# Altium schematic sheet Sheet7.SchDoc
size A4
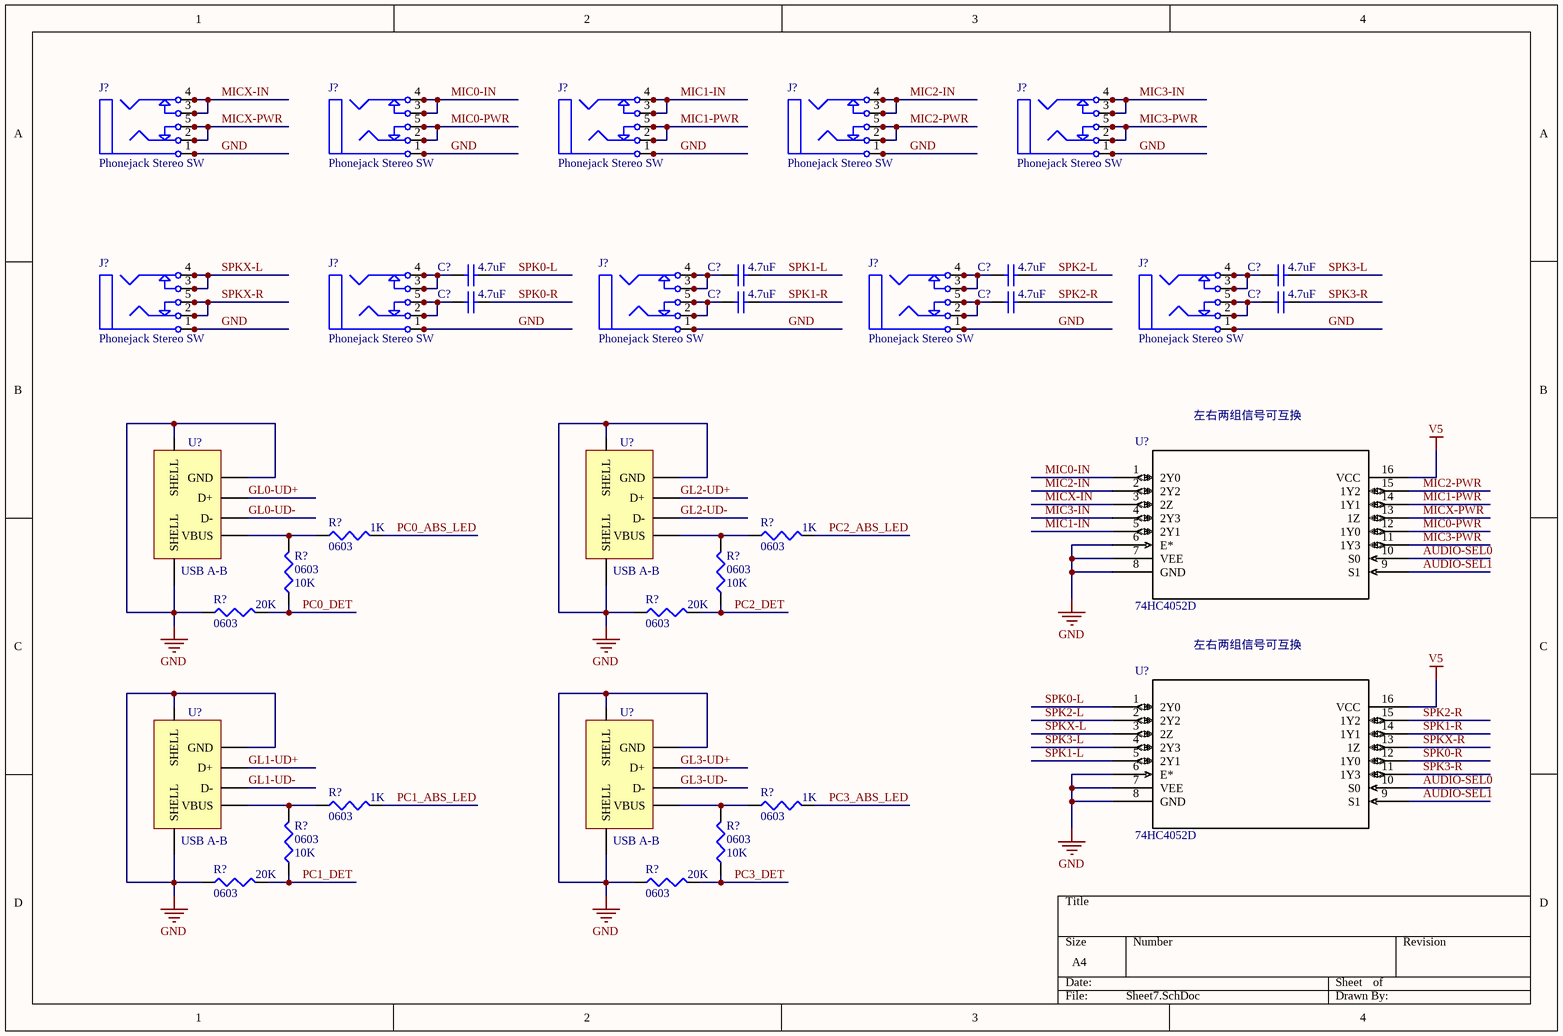
[diagram p0: Sheet7.SchDoc]

## Parts
(Parts that share a designator on the sheet are numbered #1, #2 ... from top to bottom, then left to right.)
C?#1  value 4.7uF  [1608[0603]]  (hidden comment: 0603)
C?#2  value 4.7uF  [1608[0603]]  (hidden comment: 0603)
C?#3  value 4.7uF  [1608[0603]]  (hidden comment: 0603)
C?#4  value 4.7uF  [1608[0603]]  (hidden comment: 0603)
C?#5  value 4.7uF  [1608[0603]]  (hidden comment: 0603)
C?#6  value 4.7uF  [1608[0603]]  (hidden comment: 0603)
C?#7  value 4.7uF  [1608[0603]]  (hidden comment: 0603)
C?#8  value 4.7uF  [1608[0603]]  (hidden comment: 0603)
J?#1  Phonejack Stereo SW  [ST-3150-5N]
J?#2  Phonejack Stereo SW  [ST-3150-5N]
J?#3  Phonejack Stereo SW  [ST-3150-5N]
J?#4  Phonejack Stereo SW  [ST-3150-5N]
J?#5  Phonejack Stereo SW  [ST-3150-5N]
J?#6  Phonejack Stereo SW  [ST-3150-5N]
J?#7  Phonejack Stereo SW  [ST-3150-5N]
J?#8  Phonejack Stereo SW  [ST-3150-5N]
J?#9  Phonejack Stereo SW  [ST-3150-5N]
J?#10  Phonejack Stereo SW  [ST-3150-5N]
R?#1  0603  value 1K  [J1-0603]
R?#2  0603  value 1K  [J1-0603]
R?#3  0603  value 10K  [J1-0603]
R?#4  0603  value 10K  [J1-0603]
R?#5  0603  value 20K  [J1-0603]
R?#6  0603  value 20K  [J1-0603]
R?#7  0603  value 1K  [J1-0603]
R?#8  0603  value 1K  [J1-0603]
R?#9  0603  value 10K  [J1-0603]
R?#10  0603  value 10K  [J1-0603]
R?#11  0603  value 20K  [J1-0603]
R?#12  0603  value 20K  [J1-0603]
U?#1  74HC4052D  [SOT109-1]
U?#2  USB A-B  [USB-A]
U?#3  USB A-B  [USB-A]
U?#4  74HC4052D  [SOT109-1]
U?#5  USB A-B  [USB-A]
U?#6  USB A-B  [USB-A]

## Nets
GND: J?#1.1 J?#1.1A J?#1.1B J?#2.1 J?#2.1A J?#2.1B J?#3.1 J?#3.1A J?#3.1B J?#4.1 J?#4.1A J?#4.1B J?#5.1 J?#5.1A J?#5.1B J?#6.1 J?#6.1A J?#6.1B J?#7.1 J?#7.1A J?#7.1B J?#8.1 J?#8.1A J?#8.1B J?#9.1 J?#9.1A J?#9.1B J?#10.1 J?#10.1A J?#10.1B R?#5.1 R?#6.1 R?#11.1 R?#12.1 U?#1.6(E*) U?#1.7(VEE) U?#1.8(GND) U?#2.4(GND) U?#2.5(SHELL) U?#2.6(SHELL) U?#3.4(GND) U?#3.5(SHELL) U?#3.6(SHELL) U?#4.6(E*) U?#4.7(VEE) U?#4.8(GND) U?#5.4(GND) U?#5.5(SHELL) U?#5.6(SHELL) U?#6.4(GND) U?#6.5(SHELL) U?#6.6(SHELL)
V5: U?#1.16(VCC) U?#4.16(VCC)
AUDIO-SEL0: U?#1.10(S0) U?#4.10(S0)
AUDIO-SEL1: U?#1.9(S1) U?#4.9(S1)
GL0-UD+: U?#2.3(D+)
GL0-UD-: U?#2.2(D-)
GL1-UD+: U?#5.3(D+)
GL1-UD-: U?#5.2(D-)
GL2-UD+: U?#3.3(D+)
GL2-UD-: U?#3.2(D-)
GL3-UD+: U?#6.3(D+)
GL3-UD-: U?#6.2(D-)
MIC0-IN: J?#2.3 J?#2.3A J?#2.3B J?#2.4 J?#2.4A J?#2.4B U?#1.1(2Y0)
MIC0-PWR: J?#2.2 J?#2.2A J?#2.2B J?#2.5 J?#2.5A J?#2.5B U?#1.12(1Y0)
MIC1-IN: J?#3.3 J?#3.3A J?#3.3B J?#3.4 J?#3.4A J?#3.4B U?#1.5(2Y1)
MIC1-PWR: J?#3.2 J?#3.2A J?#3.2B J?#3.5 J?#3.5A J?#3.5B U?#1.14(1Y1)
MIC2-IN: J?#4.3 J?#4.3A J?#4.3B J?#4.4 J?#4.4A J?#4.4B U?#1.2(2Y2)
MIC2-PWR: J?#4.2 J?#4.2A J?#4.2B J?#4.5 J?#4.5A J?#4.5B U?#1.15(1Y2)
MIC3-IN: J?#5.3 J?#5.3A J?#5.3B J?#5.4 J?#5.4A J?#5.4B U?#1.4(2Y3)
MIC3-PWR: J?#5.2 J?#5.2A J?#5.2B J?#5.5 J?#5.5A J?#5.5B U?#1.11(1Y3)
MICX-IN: J?#1.3 J?#1.3A J?#1.3B J?#1.4 J?#1.4A J?#1.4B U?#1.3(2Z)
MICX-PWR: J?#1.2 J?#1.2A J?#1.2B J?#1.5 J?#1.5A J?#1.5B U?#1.13(1Z)
PC0_ABS_LED: R?#1.2
PC0_DET: R?#3.1 R?#5.2
PC1_ABS_LED: R?#7.2
PC1_DET: R?#9.1 R?#11.2
PC2_ABS_LED: R?#2.2
PC2_DET: R?#4.1 R?#6.2
PC3_ABS_LED: R?#8.2
PC3_DET: R?#10.1 R?#12.2
SPK0-L: C?#1.1 U?#4.1(2Y0)
SPK0-R: C?#5.1 U?#4.12(1Y0)
SPK1-L: C?#2.1 U?#4.5(2Y1)
SPK1-R: C?#6.1 U?#4.14(1Y1)
SPK2-L: C?#3.1 U?#4.2(2Y2)
SPK2-R: C?#7.1 U?#4.15(1Y2)
SPK3-L: C?#4.1 U?#4.4(2Y3)
SPK3-R: C?#8.1 U?#4.11(1Y3)
SPKX-L: J?#6.3 J?#6.3A J?#6.3B J?#6.4 J?#6.4A J?#6.4B U?#4.3(2Z)
SPKX-R: J?#6.2 J?#6.2A J?#6.2B J?#6.5 J?#6.5A J?#6.5B U?#4.13(1Z)
NetC?#1_2: C?#1.2 J?#7.3 J?#7.3A J?#7.3B J?#7.4 J?#7.4A J?#7.4B
NetC?#2_2: C?#2.2 J?#8.3 J?#8.3A J?#8.3B J?#8.4 J?#8.4A J?#8.4B
NetC?#3_2: C?#3.2 J?#9.3 J?#9.3A J?#9.3B J?#9.4 J?#9.4A J?#9.4B
NetC?#4_2: C?#4.2 J?#10.3 J?#10.3A J?#10.3B J?#10.4 J?#10.4A J?#10.4B
NetC?#5_2: C?#5.2 J?#7.2 J?#7.2A J?#7.2B J?#7.5 J?#7.5A J?#7.5B
NetC?#6_2: C?#6.2 J?#8.2 J?#8.2A J?#8.2B J?#8.5 J?#8.5A J?#8.5B
NetC?#7_2: C?#7.2 J?#9.2 J?#9.2A J?#9.2B J?#9.5 J?#9.5A J?#9.5B
NetC?#8_2: C?#8.2 J?#10.2 J?#10.2A J?#10.2B J?#10.5 J?#10.5A J?#10.5B
NetR?#1_1: R?#1.1 R?#3.2 U?#2.1(VBUS)
NetR?#2_1: R?#2.1 R?#4.2 U?#3.1(VBUS)
NetR?#7_1: R?#7.1 R?#9.2 U?#5.1(VBUS)
NetR?#8_1: R?#8.1 R?#10.2 U?#6.1(VBUS)

## Notes on the sheet
- 左右两组信号可互换

## Library data of the parts
C?#1-C?#8 = Cap Semi: Capacitor (Semiconductor SIM Model); Published: 8-Jun-2000; LatestRevisionDate: 29-May-2009; LatestRevisionNote: IPC-7351 Footprint Added.; PackageReference: C1206; Publisher: Altium Limited; PackageDescription: Chip Capacitor
J?#1-J?#10 = Phonejack Stereo SW: 3-Conductor Jack with 2 break contacts (normals) and 2 auxiliary make contacts; Published: 5-Jan-2004; LatestRevisionDate: 17-Dec-2003; LatestRevisionNote: PCB Footprint replaced.; DatasheetDocument: 07-Mar-2000; Publisher: Altium Limited; ComponentLink1Description: Manufacturer Link; ComponentLink1URL: http://domino.kycon.com/internet/Products.html
R?#1-R?#12 = Res3: Resistor; Published: 8-Jun-2000; LatestRevisionDate: 29-May-2009; LatestRevisionNote: IPC-7351 Footprint Added.; PackageReference: J1-0603; Publisher: Altium Limited; PackageDescription: Chip Resistor
U?#1 U?#4 = 74HC4052D: Imported; Vendor: NXP; Built_By: EMA_UL_Team; C: Copyright (C) 2015 Accelerated Designs. All rights reserved; Manufacturer_Part_Number: 74hc4052d; RefDes: RefDes; Type: Type; Value: Value